# Altium schematic sheet DeejBusinessCard-LEDs.SchDoc
size B
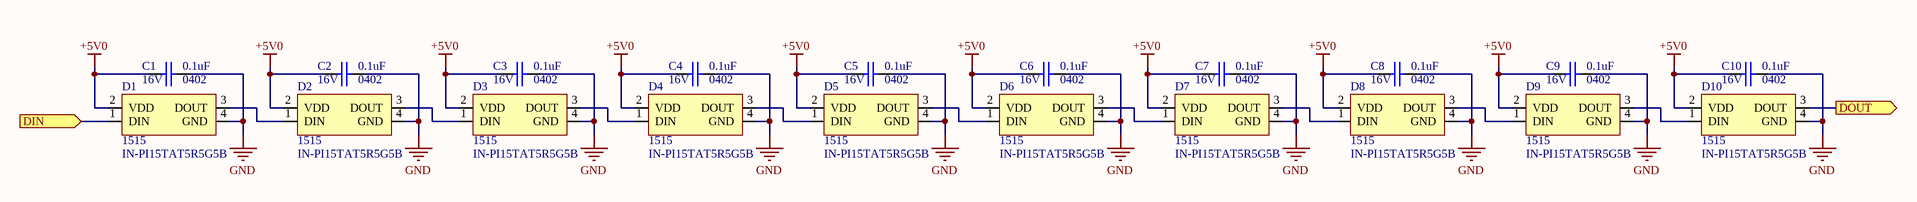
[diagram p0: DeejBusinessCard-LEDs.SchDoc]

## Parts
C1  value 0.1uF  Case/Package: 0402  Voltage: 16V  [CAPC1005L]  (hidden comment: Capacitor_Ceramic)
C2  value 0.1uF  Case/Package: 0402  Voltage: 16V  [CAPC1005L]  (hidden comment: Capacitor_Ceramic)
C3  value 0.1uF  Case/Package: 0402  Voltage: 16V  [CAPC1005L]  (hidden comment: Capacitor_Ceramic)
C4  value 0.1uF  Case/Package: 0402  Voltage: 16V  [CAPC1005L]  (hidden comment: Capacitor_Ceramic)
C5  value 0.1uF  Case/Package: 0402  Voltage: 16V  [CAPC1005L]  (hidden comment: Capacitor_Ceramic)
C6  value 0.1uF  Case/Package: 0402  Voltage: 16V  [CAPC1005L]  (hidden comment: Capacitor_Ceramic)
C7  value 0.1uF  Case/Package: 0402  Voltage: 16V  [CAPC1005L]  (hidden comment: Capacitor_Ceramic)
C8  value 0.1uF  Case/Package: 0402  Voltage: 16V  [CAPC1005L]  (hidden comment: Capacitor_Ceramic)
C9  value 0.1uF  Case/Package: 0402  Voltage: 16V  [CAPC1005L]  (hidden comment: Capacitor_Ceramic)
C10  value 0.1uF  Case/Package: 0402  Voltage: 16V  [CAPC1005L]  (hidden comment: Capacitor_Ceramic)
D1  PCB Footprint: 1515  [IN-PI15TAT5R5G5B]  (hidden comment: IN-PI15TAT5R5G5B)
D2  PCB Footprint: 1515  [IN-PI15TAT5R5G5B]  (hidden comment: IN-PI15TAT5R5G5B)
D3  PCB Footprint: 1515  [IN-PI15TAT5R5G5B]  (hidden comment: IN-PI15TAT5R5G5B)
D4  PCB Footprint: 1515  [IN-PI15TAT5R5G5B]  (hidden comment: IN-PI15TAT5R5G5B)
D5  PCB Footprint: 1515  [IN-PI15TAT5R5G5B]  (hidden comment: IN-PI15TAT5R5G5B)
D6  PCB Footprint: 1515  [IN-PI15TAT5R5G5B]  (hidden comment: IN-PI15TAT5R5G5B)
D7  PCB Footprint: 1515  [IN-PI15TAT5R5G5B]  (hidden comment: IN-PI15TAT5R5G5B)
D8  PCB Footprint: 1515  [IN-PI15TAT5R5G5B]  (hidden comment: IN-PI15TAT5R5G5B)
D9  PCB Footprint: 1515  [IN-PI15TAT5R5G5B]  (hidden comment: IN-PI15TAT5R5G5B)
D10  PCB Footprint: 1515  [IN-PI15TAT5R5G5B]  (hidden comment: IN-PI15TAT5R5G5B)

## Ports
DIN (in), DOUT (out)

## Nets
+5V0: C1.2 C2.2 C3.2 C4.2 C5.2 C6.2 C7.2 C8.2 C9.2 C10.2 D1.2(VDD) D2.2(VDD) D3.2(VDD) D4.2(VDD) D5.2(VDD) D6.2(VDD) D7.2(VDD) D8.2(VDD) D9.2(VDD) D10.2(VDD)
GND: C1.1 C2.1 C3.1 C4.1 C5.1 C6.1 C7.1 C8.1 C9.1 C10.1 D1.4(GND) D2.4(GND) D3.4(GND) D4.4(GND) D5.4(GND) D6.4(GND) D7.4(GND) D8.4(GND) D9.4(GND) D10.4(GND)
DIN: D1.1(DIN) ; port DIN
DOUT: D10.3(DOUT) ; port DOUT
NetD1_3: D1.3(DOUT) D2.1(DIN)
NetD2_3: D2.3(DOUT) D3.1(DIN)
NetD3_3: D3.3(DOUT) D4.1(DIN)
NetD4_3: D4.3(DOUT) D5.1(DIN)
NetD5_3: D5.3(DOUT) D6.1(DIN)
NetD6_3: D6.3(DOUT) D7.1(DIN)
NetD7_3: D7.3(DOUT) D8.1(DIN)
NetD8_3: D8.3(DOUT) D9.1(DIN)
NetD9_3: D9.3(DOUT) D10.1(DIN)

## Notes on the sheet
- Title:
- Size:
- Drawn By:
- B
- Number:
- Date:
- Sheet
- Rev.
- of
- 42 ENGINEERING, LLC
- File:
- 844-364-4242
- http://www.42-e.com

## Library data of the parts
C1-C10 = CC0402KRX7R7BB104: CAP CER 0.1UF 16V X7R 0402; Manufacturer 1: Yageo; Part Number: CC0402KRX7R7BB104; Supplier Part Number 1: 311-1338-1-ND; Manufacturer Part Number 1: CC0402KRX7R7BB104
D1-D10 = IN-PI15TAT5R5G5B: Addressable Lighting - 1 LED Discrete Red, Green, Blue (RGB) 1.50mm L x 1.50mm W; Manufacturer: Inolux; Unit: EA; RoHS: Yes; Supplier 1: Digikey; Supplier Part Number 1: 1830-IN-PI15TAT5R5G5BCT-ND; Part Number: IN-PI15TAT5R5G5B